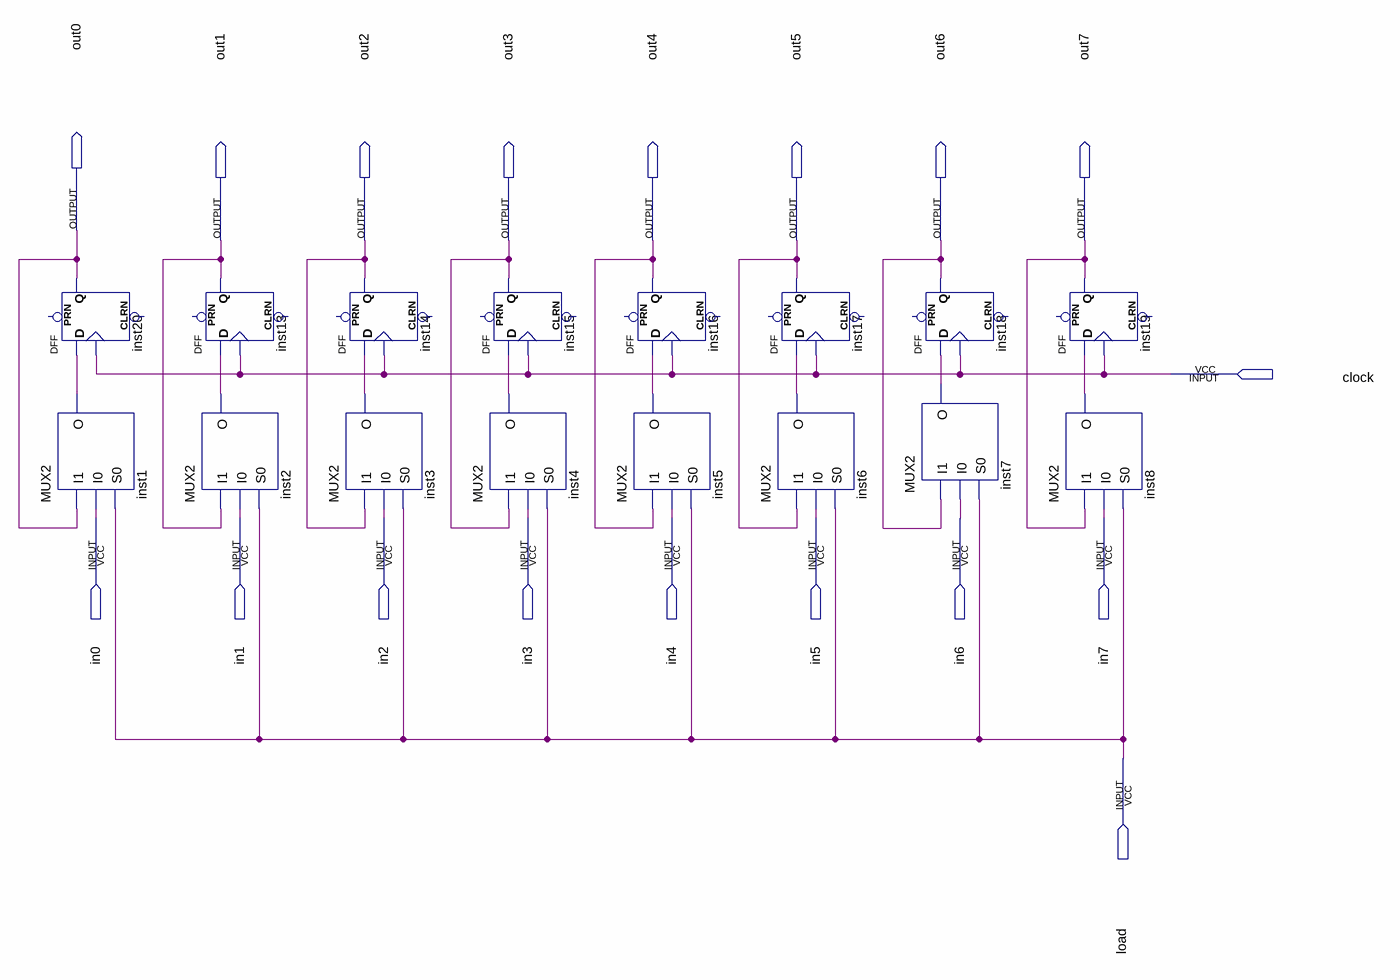
[diagram p0: schematic sheet]
// Quartus schematic register8.bdf as structural Verilog: 16 symbols, 18 pins
module register8 (
  input  clock,
  input  in0,
  input  in1,
  input  in2,
  input  in3,
  input  in4,
  input  in5,
  input  in6,
  input  in7,
  input  load,
  output out0,
  output out1,
  output out2,
  output out3,
  output out4,
  output out5,
  output out6,
  output out7
);

  wire inst1_o, inst2_o, inst3_o, inst4_o, inst5_o, inst6_o, inst7_o, inst8_o;

  MUX2 inst1 (.I1(out0), .I0(in0), .S0(load), .O(inst1_o));
  DFF inst20 (.CLK(clock), .D(inst1_o), .Q(out0));  // open: CLRN, PRN
  DFF inst13 (.CLK(clock), .D(inst2_o), .Q(out1));  // open: CLRN, PRN
  MUX2 inst2 (.I1(out1), .I0(in1), .S0(load), .O(inst2_o));
  DFF inst14 (.CLK(clock), .D(inst3_o), .Q(out2));  // open: CLRN, PRN
  MUX2 inst3 (.I1(out2), .I0(in2), .S0(load), .O(inst3_o));
  DFF inst15 (.CLK(clock), .D(inst4_o), .Q(out3));  // open: CLRN, PRN
  MUX2 inst4 (.I1(out3), .I0(in3), .S0(load), .O(inst4_o));
  DFF inst16 (.CLK(clock), .D(inst5_o), .Q(out4));  // open: CLRN, PRN
  MUX2 inst5 (.I1(out4), .I0(in4), .S0(load), .O(inst5_o));
  DFF inst17 (.CLK(clock), .D(inst6_o), .Q(out5));  // open: CLRN, PRN
  MUX2 inst6 (.I1(out5), .I0(in5), .S0(load), .O(inst6_o));
  DFF inst18 (.CLK(clock), .D(inst7_o), .Q(out6));  // open: CLRN, PRN
  MUX2 inst7 (.I1(out6), .I0(in6), .S0(load), .O(inst7_o));
  DFF inst19 (.CLK(clock), .D(inst8_o), .Q(out7));  // open: CLRN, PRN
  MUX2 inst8 (.I1(out7), .I0(in7), .S0(load), .O(inst8_o));
endmodule
